# Altium schematic sheet lipo_board.SchDoc
size A
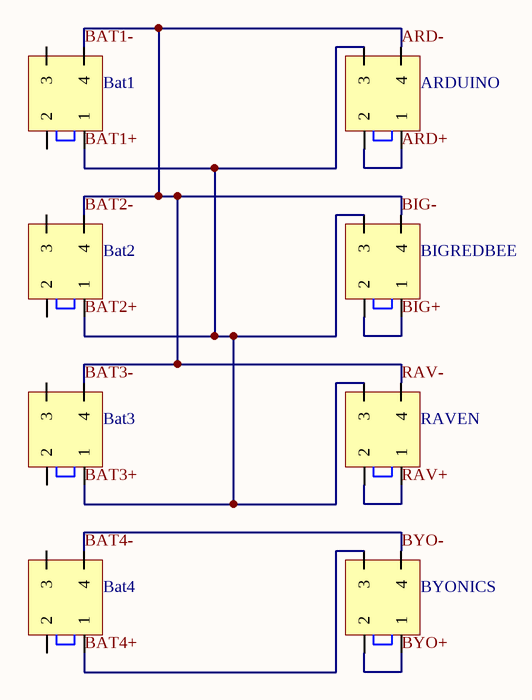
[diagram p0: lipo_board.SchDoc]

## Parts
ARDUINO  5566-4  [5566-4]  (value not drawn)
Bat1  5566-4  [5566-4]  (value not drawn)
Bat2  5566-4  [5566-4]  (value not drawn)
Bat3  5566-4  [5566-4]  (value not drawn)
Bat4  5566-4  [5566-4]  (value not drawn)
BIGREDBEE  5566-4  [5566-4]  (value not drawn)
BYONICS  5566-4  [5566-4]  (value not drawn)
RAVEN  5566-4  [5566-4]  (value not drawn)

## Nets
ARD+: ARDUINO.1 ARDUINO.2
ARD-: ARDUINO.4 Bat1.4 Bat2.4 Bat3.4 BIGREDBEE.4 RAVEN.4  [also labelled BAT1-, BAT2-, BAT3-, BIG-, RAV-]
BAT1+: ARDUINO.3 Bat1.1 Bat2.1 Bat3.1 BIGREDBEE.3 RAVEN.3  [also labelled BAT2+, BAT3+]
BAT4+: Bat4.1 BYONICS.3
BAT4-: Bat4.4 BYONICS.4  [also labelled BYO-]
BIG+: BIGREDBEE.1 BIGREDBEE.2
BYO+: BYONICS.1 BYONICS.2
RAV+: RAVEN.1 RAVEN.2

Not connected (* = marked no-connect by the designer): Bat1 2 3; Bat2 2 3; Bat3 2 3; Bat4 2 3

## Library data of the parts
ARDUINO Bat1-Bat4 BIGREDBEE BYONICS RAVEN = 5566-4: 4.20mm (.165") Pitch Mini-Fit Jr.™ Header, Dual Row, Vertical, without Snap-in Plastic Peg PCB Lock, 4 Circuits, PA Polyamide Nylon 6/6 94V-2, Tin (Sn) Plating, without Drain Holes